# Altium schematic sheet E17-04-Energy_Meter.SchDoc
size A
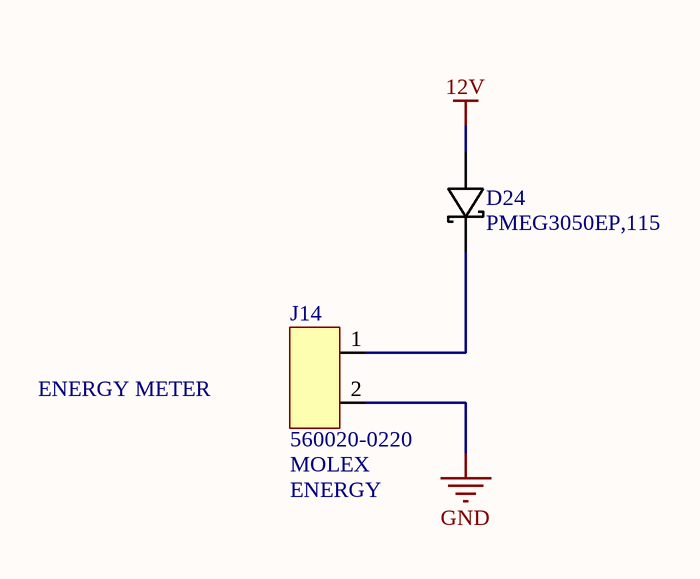
[diagram p0: E17-04-Energy_Meter.SchDoc]

## Parts
D24  MFG_PN: PMEG3050EP,115  [SOD-128]  (hidden comment: D_PMEG3050EP,115)
J14  ENERGY  MANUFACTURER: MOLEX  [MOLEX_DURACLIK_2 NAT VERT]

## Nets
12V: D24.1
GND: J14.2
NetD24_2: D24.2 J14.1

## Notes on the sheet
- ENERGY METER

## Library data of the parts
D24 = D_PMEG3050EP,115: DIODE SCHOTTKY 360mV 30V 5A; MFG: Nexperia; Supplier: Digikey; Supplier_PN: 1727-5317-1-ND
J14 = 560020-0220: MOLEX DURACLIK 2-PIN VERT NAT; POSITIONS: 2; UL: 94V-0; VOLTAGE: 125; CURRENT: 3; PLATING: Tin (Sn); Digikey_PN: Not in production; COLOR: NAT; SERIES: Duraclik; ORIENTATOIN: VERT; MPN: 560020-0220